# EAGLE schematic traintimes (EAGLE 6.5.0)
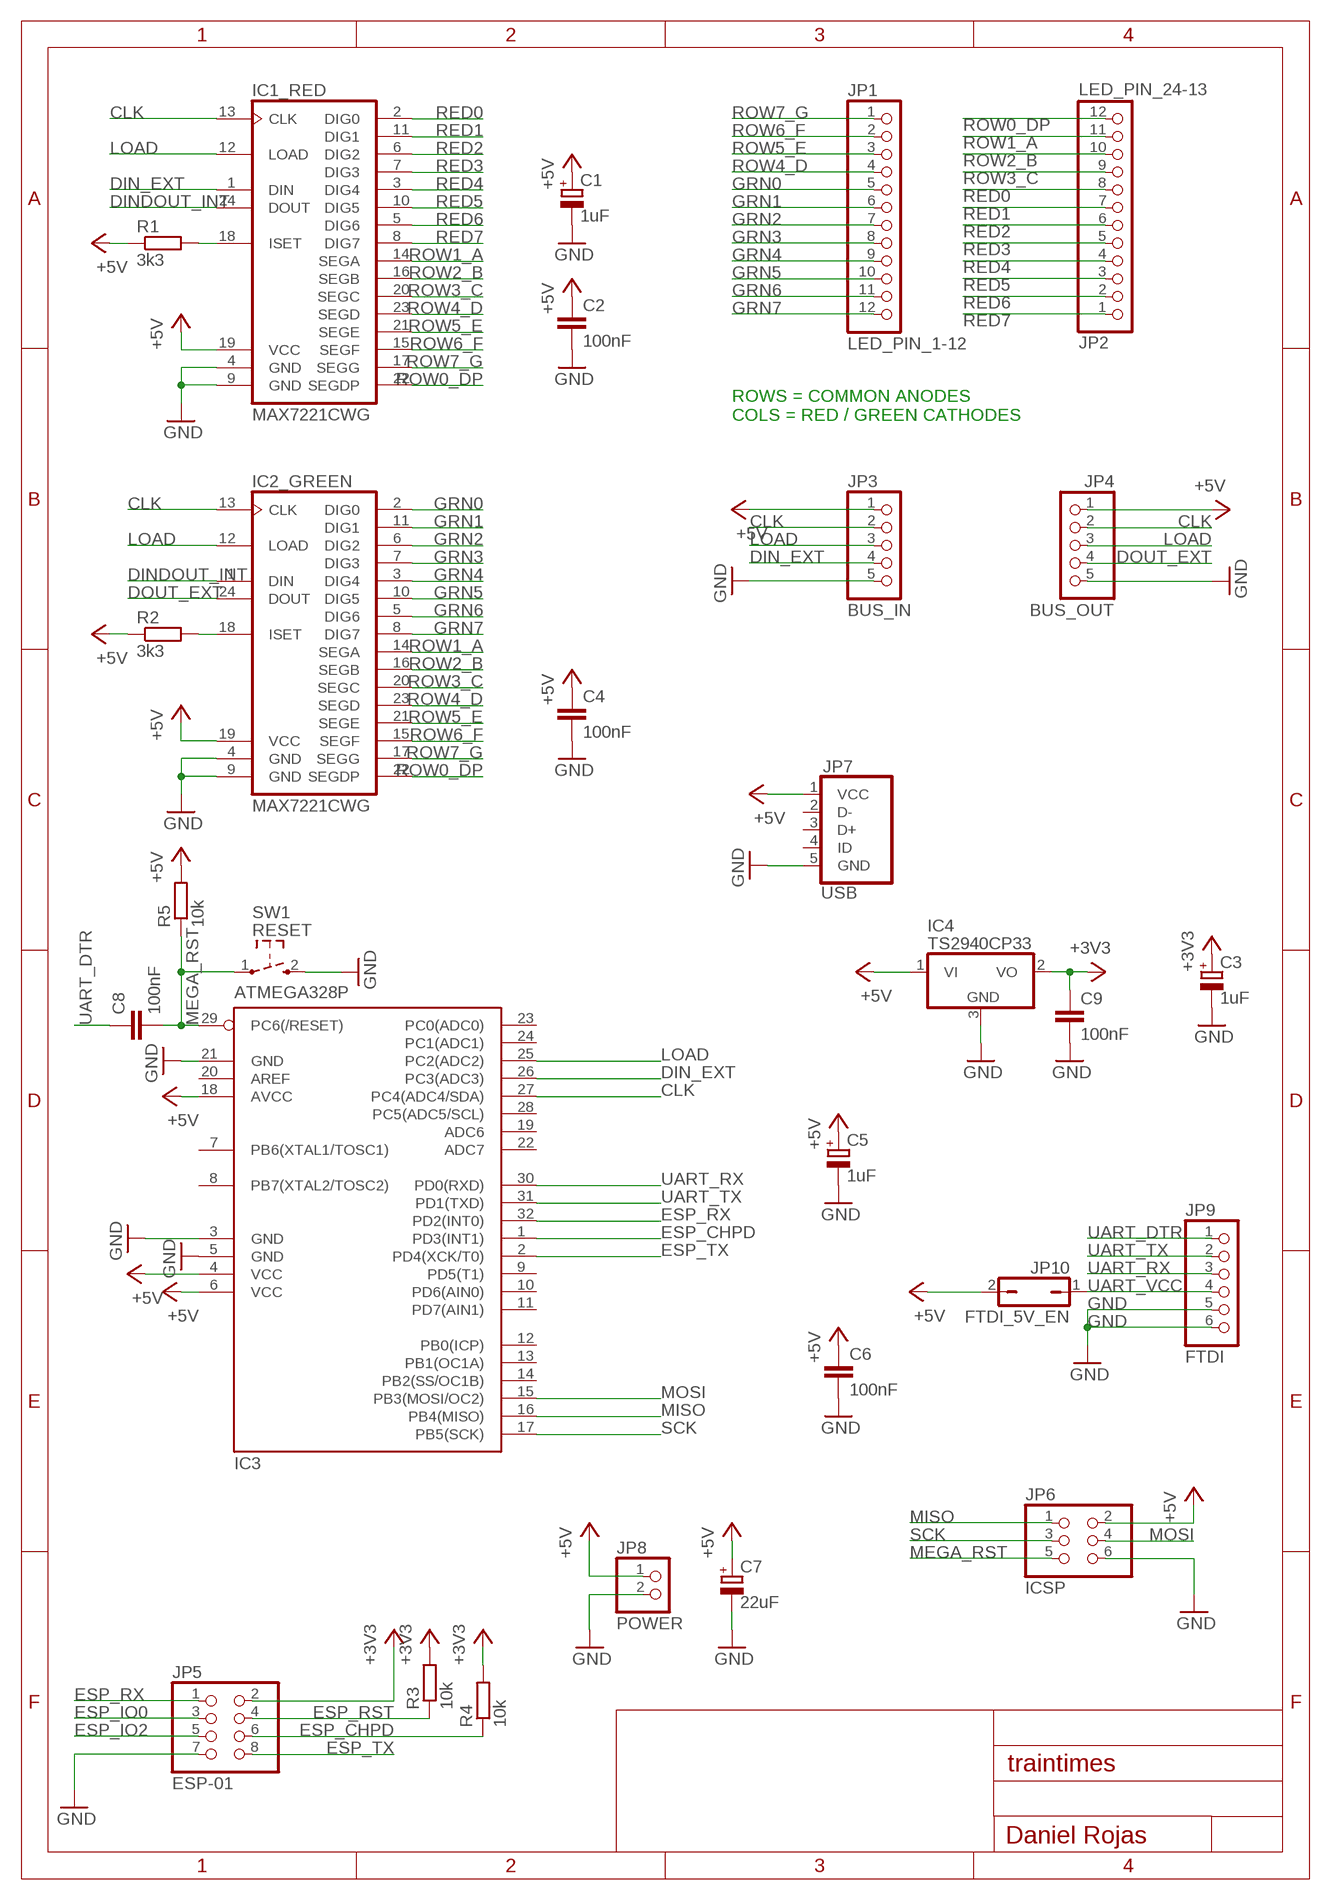
[diagram p0: schematic, sheet 1]

## Parts
C1  1uF  CPOL-EUSMCA  [SMC_A]
C2  100nF  C-EUC0805  [C0805]
C3  1uF  CPOL-EUSMCA  [SMC_A]
C4  100nF  C-EUC0805  [C0805]
C5  1uF  CPOL-EUSMCA  [SMC_A]
C6  100nF  C-EUC0805  [C0805]
C7  22uF  CPOL-EUE2.5-6  [E2,5-6]
C8  100nF  C-EUC0805  [C0805]
C9  100nF  C-EUC0805  [C0805]
IC1_RED  MAX7221CWG  MAX7219CWG  [SO24L]
IC2_GREEN  MAX7221CWG  MAX7219CWG  [SO24L]
IC3  ATMEGA328P  MEGA8-AI  [TQFP32-08]
IC4  TS2940CP33  7805DT  [TO252]
JP1  LED_PIN_1-12  PINHD-1X12  [1X12]
JP2  LED_PIN_24-13  PINHD-1X12  [1X12]
JP3  BUS_IN  PINHD-1X5  [1X05]
JP4  BUS_OUT  PINHD-1X5  [1X05]
JP5  ESP-01  PINHD-2X4  [2X04]
JP6  ICSP  PINHD-2X3  [2X03]
JP7  USB  USB-RECEPTABLE  [FCI-10103594-0001LF]
JP8  POWER  PINHD-1X2  [1X02]
JP9  FTDI  PINHD-1X6  [1X06]
JP10  FTDI_5V_EN  JP1Q  [JP1]
R1  3k3  R-EU_R0805  [R0805]
R2  3k3  R-EU_R0805  [R0805]
R3  10k  R-EU_R0805  [R0805]
R4  10k  R-EU_R0805  [R0805]
R5  10k  R-EU_R0805  [R0805]
SW1  RESET  SW_TACT_2P-3X6  [SW_TACT_3X6]

## Nets
+3V3: C3.+ C9.1 IC4.2(VO) JP5.2 R3.2 R4.2
+5V: C1.+ C2.1 C4.1 C5.+ C6.1 C7.+ IC1_RED.19(VCC) IC2_GREEN.19(VCC) IC3.4(VCC) IC3.6(VCC) IC3.18(AVCC) IC4.1(VI) JP3.1 JP4.1 JP6.2 JP7.1(VCC) JP8.1 JP10.2 R1.1 R2.1 R5.2
CLK: IC1_RED.13(CLK) IC2_GREEN.13(CLK) IC3.27(PC4(ADC4/SDA)) JP3.2 JP4.2
DIN_EXT: IC1_RED.1(DIN) IC3.26(PC3(ADC3)) JP3.4
DINDOUT_INT: IC1_RED.24(DOUT) IC2_GREEN.1(DIN)
DOUT_EXT: IC2_GREEN.24(DOUT) JP4.4
ESP_CHPD: IC3.1(PD3(INT1)) JP5.6 R4.1
ESP_IO0: JP5.3
ESP_IO2: JP5.5
ESP_RST: JP5.4 R3.1
ESP_RX: IC3.32(PD2(INT0)) JP5.1
ESP_TX: IC3.2(PD4(XCK/T0)) JP5.8
GND: C1.- C2.2 C3.- C4.2 C5.- C6.2 C7.- C9.2 IC1_RED.4(GND) IC1_RED.9(GND) IC2_GREEN.4(GND) IC2_GREEN.9(GND) IC3.3(GND) IC3.5(GND) IC3.21(GND) IC4.3(GND) JP3.5 JP4.5 JP5.7 JP6.6 JP7.5(GND) JP8.2 JP9.5 JP9.6 SW1.2
GRN0: IC2_GREEN.2(DIG0) JP1.5
GRN1: IC2_GREEN.11(DIG1) JP1.6
GRN2: IC2_GREEN.6(DIG2) JP1.7
GRN3: IC2_GREEN.7(DIG3) JP1.8
GRN4: IC2_GREEN.3(DIG4) JP1.9
GRN5: IC2_GREEN.10(DIG5) JP1.10
GRN6: IC2_GREEN.5(DIG6) JP1.11
GRN7: IC2_GREEN.8(DIG7) JP1.12
ISET1: IC1_RED.18(ISET) R1.2
ISET2: IC2_GREEN.18(ISET) R2.2
LOAD: IC1_RED.12(LOAD) IC2_GREEN.12(LOAD) IC3.25(PC2(ADC2)) JP3.3 JP4.3
MEGA_RST: C8.2 IC3.29(PC6(/RESET)) JP6.5 R5.1 SW1.1
MISO: IC3.16(PB4(MISO)) JP6.1
MOSI: IC3.15(PB3(MOSI/OC2)) JP6.4
RED0: IC1_RED.2(DIG0) JP2.8
RED1: IC1_RED.11(DIG1) JP2.7
RED2: IC1_RED.6(DIG2) JP2.6
RED3: IC1_RED.7(DIG3) JP2.5
RED4: IC1_RED.3(DIG4) JP2.4
RED5: IC1_RED.10(DIG5) JP2.3
RED6: IC1_RED.5(DIG6) JP2.2
RED7: IC1_RED.8(DIG7) JP2.1
ROW0_DP: IC1_RED.22(SEGDP) IC2_GREEN.22(SEGDP) JP2.12
ROW1_A: IC1_RED.14(SEGA) IC2_GREEN.14(SEGA) JP2.11
ROW2_B: IC1_RED.16(SEGB) IC2_GREEN.16(SEGB) JP2.10
ROW3_C: IC1_RED.20(SEGC) IC2_GREEN.20(SEGC) JP2.9
ROW4_D: IC1_RED.23(SEGD) IC2_GREEN.23(SEGD) JP1.4
ROW5_E: IC1_RED.21(SEGE) IC2_GREEN.21(SEGE) JP1.3
ROW6_F: IC1_RED.15(SEGF) IC2_GREEN.15(SEGF) JP1.2
ROW7_G: IC1_RED.17(SEGG) IC2_GREEN.17(SEGG) JP1.1
SCK: IC3.17(PB5(SCK)) JP6.3
UART_DTR: C8.1 JP9.1
UART_RX: IC3.30(PD0(RXD)) JP9.3
UART_TX: IC3.31(PD1(TXD)) JP9.2
UART_VCC: JP9.4 JP10.1
Unconnected: IC3.7(PB6(XTAL1/TOSC1)) IC3.8(PB7(XTAL2/TOSC2)) IC3.9(PD5(T1)) IC3.10(PD6(AIN0)) IC3.11(PD7(AIN1)) IC3.12(PB0(ICP)) IC3.13(PB1(OC1A)) IC3.14(PB2(SS/OC1B)) IC3.19(ADC6) IC3.20(AREF) IC3.22(ADC7) IC3.23(PC0(ADC0)) IC3.24(PC1(ADC1)) IC3.28(PC5(ADC5/SCL)) JP7.2(D-) JP7.3(D+) JP7.4(ID)

## Notes on the sheet
- ROWS = COMMON ANODES
  COLS = RED / GREEN CATHODES

## Library data of the parts
C1 C3 C5 C7 = rcl:CPOL-EU: POLARIZED CAPACITOR, European symbol
C2 C4 C6 C8 C9 = rcl:C-EU: CAPACITOR, European symbol
IC1_RED IC2_GREEN = max7219:MAX7219CWG
IC3 = atmel:MEGA8: MICROCONTROLLER 8 Kbytes FLASH, 1 kbytes SRAM, 512 bytes EEPROM, USART, 6-channel 10 bit ADC, 2-channel 8 bit ADC Pin compatible with Atmega48, ATMega88, ATMega168 Source: avr.lbr; MPN: ATMEGA8-16AU; OC_FARNELL: 9171371; OC_NEWARK: 73M8863
IC4 = linear:78*: Positive VOLTAGE REGULATOR Source: http://cache.national.com/ds/LM/LM78L05.pdf http://www.fairchildsemi.com/ds/LM/LM7805.pdf
JP1 JP2 = pinhead:PINHD-1X12: PIN HEADER
JP3 JP4 = pinhead:PINHD-1X5: PIN HEADER
JP5 = pinhead:PINHD-2X4: PIN HEADER
JP6 = pinhead:PINHD-2X3: PIN HEADER
JP7 = daspilker:USB-RECEPTABLE: USB Receptable
JP8 = pinhead:PINHD-1X2: PIN HEADER
JP9 = pinhead:PINHD-1X6: PIN HEADER
JP10 = jumper:JP1Q: JUMPER
R1-R5 = rcl:R-EU_: RESISTOR, European symbol
SW1 = dp_devices:SW_TACT_2P